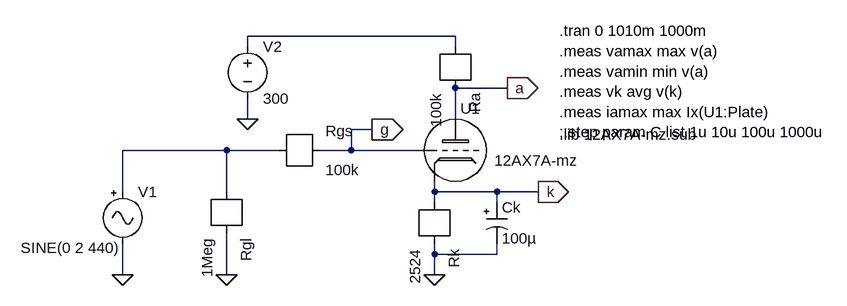
[diagram p0: schematic 12ax7-amp.asc]
12ax7-amp.asc, the LTspice schematic file:
Version 4
SHEET 1 1056 680
WIRE 368 128 48 128
WIRE 48 144 48 128
WIRE 368 144 368 128
WIRE 448 208 368 208
WIRE 48 256 48 224
WIRE 368 256 368 208
WIRE 240 272 208 272
WIRE 16 304 -144 304
WIRE 96 304 16 304
WIRE 208 304 208 272
WIRE 208 304 160 304
WIRE 320 304 208 304
WIRE -144 368 -144 304
WIRE 16 368 16 304
WIRE 336 368 336 352
WIRE 432 368 336 368
WIRE 496 368 432 368
WIRE 336 384 336 368
WIRE 432 384 432 368
WIRE 336 464 336 448
WIRE 432 464 432 448
WIRE 432 464 336 464
WIRE -144 496 -144 448
WIRE 16 496 16 432
WIRE 336 496 336 464
FLAG -144 496 0
FLAG 48 256 0
FLAG 336 496 0
FLAG 496 368 k
IOPIN 496 368 Out
FLAG 240 272 g
IOPIN 240 272 Out
FLAG 448 208 a
IOPIN 448 208 Out
FLAG 16 496 0
SYMBOL signal -144 352 R0
WINDOW 3 -157 102 Left 2
SYMATTR Value SINE(0 2 440)
SYMATTR InstName V1
SYMBOL r 368 144 R90
SYMATTR InstName Ra
SYMATTR Value 100k
SYMBOL voltage 48 128 R0
SYMATTR InstName V2
SYMATTR Value 300
SYMBOL r 336 384 R90
SYMATTR InstName Rk
SYMATTR Value 2524
SYMBOL polcap 416 384 R0
SYMATTR InstName Ck
SYMATTR Value 100µ
SYMBOL r 96 304 R0
SYMATTR InstName Rgs
SYMATTR Value 100k
SYMBOL r 16 368 R90
SYMATTR InstName Rgl
SYMATTR Value 1Meg
SYMBOL 12AX7A-mz 368 304 R0
WINDOW 3 60 16 Left 2
SYMATTR InstName U1
TEXT 528 120 Left 2 !.tran 0 1010m 1000m\n.meas vamax max v(a)\n.meas vamin min v(a)\n.meas vk avg v(k)\n.meas iamax max Ix(U1:Plate)\n;.step param C list 1u 10u 100u 1000u
TEXT 528 280 Left 2 !.lib 12AX7A-mz.sub

The netlist it stands for:
* 12ax7-amp.asc
V1 N002 0 SINE(0 2 440)
Ra a N001 100k
V2 N001 0 300
Rk 0 k 2524
Ck k 0 100µ
Rgs g N002 100k
Rgl 0 N002 1Meg
XU1 a g k 12AX7A-mz  ; pins Plate Grid Cathode
.tran 0 1010m 1000m
.meas vamax max v(a)
.meas vamin min v(a)
.meas vk avg v(k)
.meas iamax max Ix(U1:Plate)
;.step param C list 1u 10u 100u 1000u
.lib 12AX7A-mz.sub
.lib 12AX7A-mz.sub
.backanno
.end